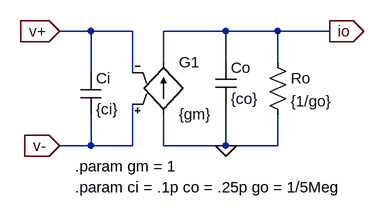
[diagram p0: schematic OTA.asc]
OTA.asc, the LTspice schematic file:
Version 4
SHEET 1 880 680
WIRE -16 80 -64 80
WIRE 48 80 -16 80
WIRE 192 80 96 80
WIRE 272 80 192 80
WIRE 352 80 272 80
WIRE 96 128 96 80
WIRE 192 128 192 80
WIRE 272 128 272 80
WIRE -16 144 -16 80
WIRE 48 144 48 80
WIRE -16 256 -16 208
WIRE -16 256 -64 256
WIRE 48 256 48 192
WIRE 48 256 -16 256
WIRE 96 256 96 208
WIRE 192 256 192 192
WIRE 192 256 96 256
WIRE 272 256 272 208
WIRE 272 256 192 256
FLAG 352 80 io
IOPIN 352 80 Out
FLAG -64 80 v+
IOPIN -64 80 In
FLAG -64 256 v-
IOPIN -64 256 In
FLAG 192 256 0
SYMBOL cap -32 144 R0
SYMATTR InstName Ci
SYMATTR Value {ci}
SYMATTR SpiceLine Rser=0
SYMBOL cap 176 128 R0
SYMATTR InstName Co
SYMATTR Value {co}
SYMATTR SpiceLine Rser=0
SYMBOL res 256 112 R0
SYMATTR InstName Ro
SYMATTR Value {1/go}
SYMBOL g2 96 112 R0
SYMATTR InstName G1
SYMATTR Value {gm}
TEXT -40 288 Left 2 !.param gm = 1
TEXT -40 320 Left 2 !.param ci = .1p co = .25p go = 1/5Meg

The netlist it stands for:
* OTA.asc
Ci v+ v- {ci} Rser=0
Co io 0 {co} Rser=0
Ro io 0 {1/go}
G1 0 io v- v+ {gm}
.param gm = 1
.param ci = .1p co = .25p go = 1/5Meg
.backanno
.end